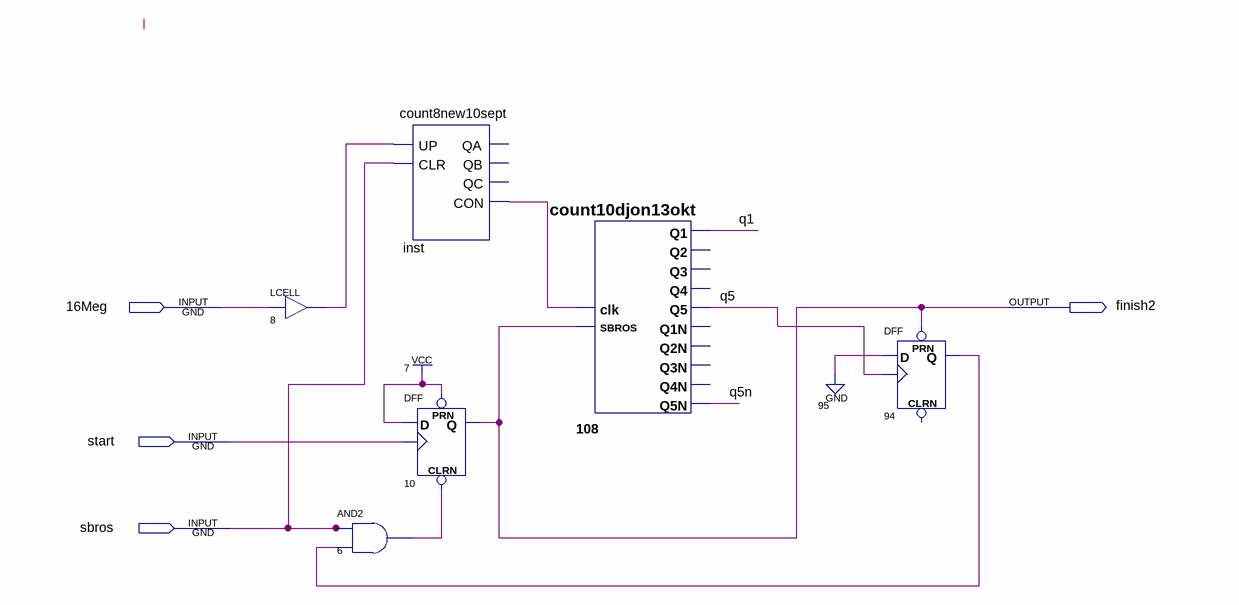
[diagram p0: schematic sheet]
// Quartus schematic rasshiritel2mart.bdf as structural Verilog: 6 symbols, 4 pins
module rasshiritel2mart (
  input  \16Meg ,
  input  start,
  input  sbros,
  output finish2
);

  wire inst_con, n6_out, n8_out, n94_q, q1, q5, q5n;

  LCELL u_8 (.IN(\16Meg ), .OUT(n8_out));
  and u_6 (n6_out, sbros, n94_q);
  count8new10sept inst (.UP(n8_out), .CLR(sbros), .CON(inst_con));  // open: QA, QB, QC
  DFF u_10 (.CLRN(n6_out), .CLK(start), .D(1'b1), .PRN(1'b1), .Q(finish2));
  count10djon13okt u_108 (
    .clk(inst_con), .SBROS(finish2), .Q1(q1), .Q5(q5), .Q5N(q5n));  // open: Q2, Q3, Q4, Q1N, Q2N, Q3N, Q4N
  DFF u_94 (.CLK(q5), .D(1'b0), .PRN(finish2), .Q(n94_q));  // open: CLRN
endmodule
